# Altium schematic sheet CW313 Front Page.SchDoc: CW313 Front Page
size Letter; Organization: NewAE Technology Inc.; Address1: 1083 Queen St., Suite 196; Address2: Halifax; Address3: NS; Address4: Canada B3H 0B2; SheetNumber: 1; SheetTotal: 4; SheetApproved: YES
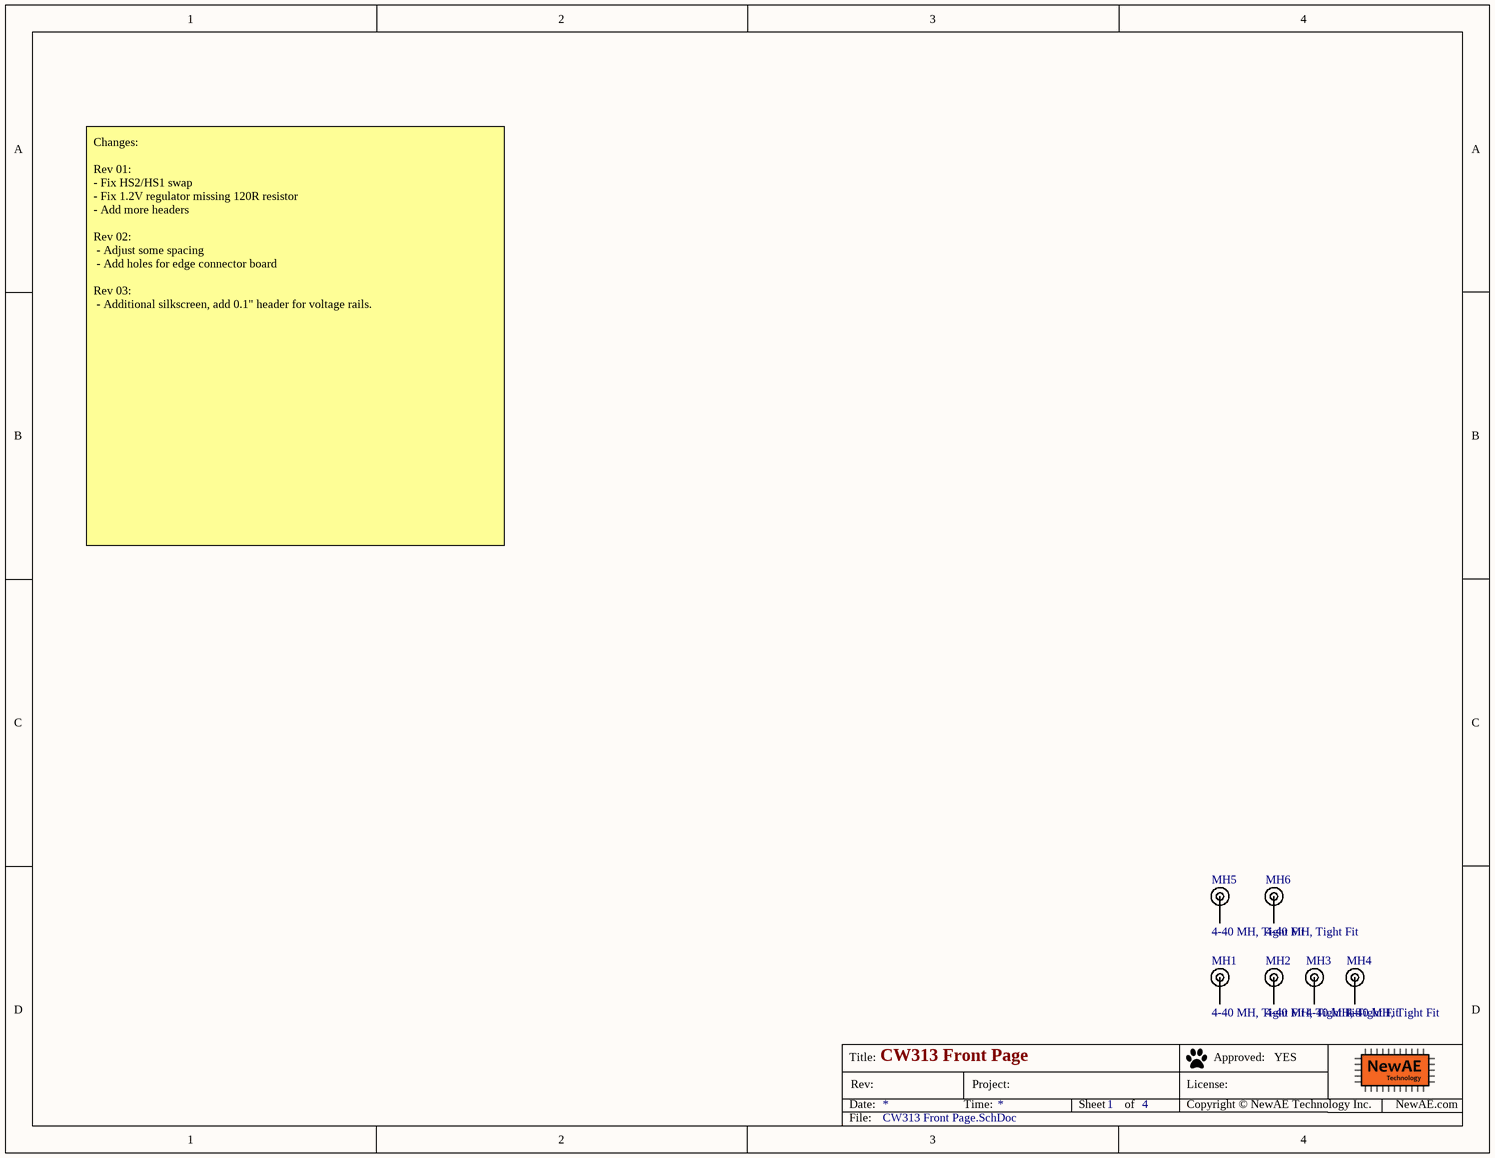
[diagram p0: CW313 Front Page.SchDoc]

## Parts
MH1  4-40 MH, Tight Fit  [MOUNT_#4_TIGHT]
MH2  4-40 MH, Tight Fit  [MOUNT_#4_TIGHT]
MH3  4-40 MH, Tight Fit  [MOUNT_#4_TIGHT]
MH4  4-40 MH, Tight Fit  [MOUNT_#4_TIGHT]
MH5  4-40 MH, Tight Fit  [MOUNT_#4_TIGHT]
MH6  4-40 MH, Tight Fit  [MOUNT_#4_TIGHT]

## Nets

Not connected (* = marked no-connect by the designer): MH1 1; MH2 1; MH3 1; MH4 1; MH5 1; MH6 1

## Notes on the sheet
- Changes:
  Rev 01:
  - Fix HS2/HS1 swap
  - Fix 1.2V regulator missing 120R resistor
  - Add more headers
  Rev 02:
  - Adjust some spacing
  - Add holes for edge connector board
  Rev 03:
  - Additional silkscreen, add 0.1" header for voltage rails.
- Title:
- Date:
- Rev:
- Time:
- Project:
- Sheet
- of
- License:
- Copyright © NewAE Technology Inc.
- Approved:
- NewAE.com
- File:

## Library data of the parts
MH1-MH6 = MOUNT_#4_TIGHT: Machine screw 4-40 Mounting Hole; Component Group: Mechanical; PP Material Stack: 0; Part Number: MOUNT_#4_TIGHT; Pin Count: 1; Component Kind: Mechanical; Component Type: Mechanical; PP Rotation: 0